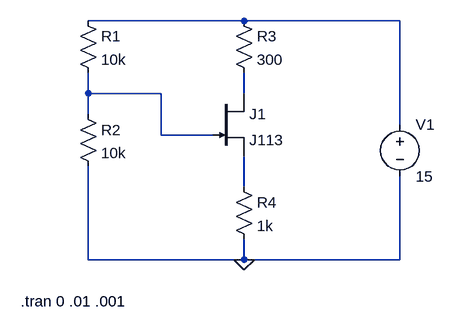
[diagram p0: schematic divider_bias.asc]
divider_bias.asc, the LTspice schematic file:
Version 4
SHEET 1 880 680
WIRE 576 80 336 80
WIRE 816 80 576 80
WIRE 336 192 336 160
WIRE 448 192 336 192
WIRE 576 192 576 160
WIRE 336 224 336 192
WIRE 816 240 816 80
WIRE 448 256 448 192
WIRE 528 256 448 256
WIRE 576 336 576 288
WIRE 336 448 336 304
WIRE 576 448 576 416
WIRE 576 448 336 448
WIRE 816 448 816 320
WIRE 816 448 576 448
FLAG 576 448 0
SYMBOL Res 320 64 R0
SYMATTR InstName R1
SYMATTR Value 10k
SYMBOL Res 320 208 R0
SYMATTR InstName R2
SYMATTR Value 10k
SYMBOL Res 560 64 R0
SYMATTR InstName R3
SYMATTR Value 300
SYMBOL Res 560 320 R0
SYMATTR InstName R4
SYMATTR Value 1k
SYMBOL njf 528 192 R0
SYMATTR InstName J1
SYMATTR Value J113
SYMBOL Voltage 816 224 R0
SYMATTR InstName V1
SYMATTR Value 15
TEXT 232 512 Left 2 !.tran 0 .01 .001

The netlist it stands for:
* divider_bias.asc
R1 N001 N002 10k
R2 N002 0 10k
R3 N001 N003 300
R4 N004 0 1k
J1 N003 N002 N004 J113
V1 N001 0 15
.model NJF NJF
.model PJF PJF
.lib standard.jft
.tran 0 .01 .001
.backanno
.end